# EAGLE schematic VCO (EAGLE 8.6.0)
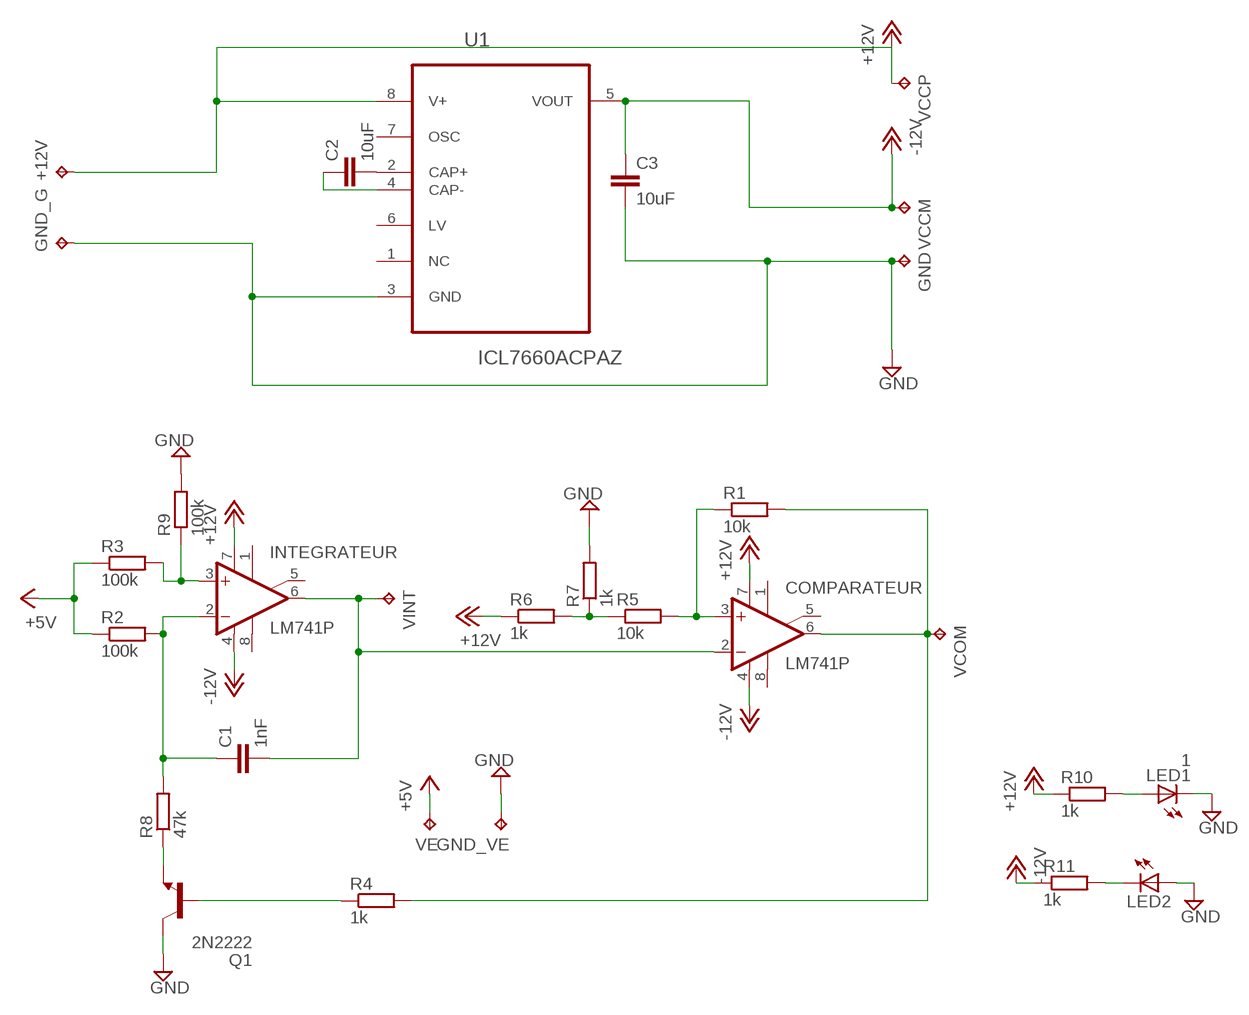
[diagram p0: schematic, sheet 1]

## Parts
+12V  TPPAD1-13  [P1-13]
C1  1nF  C050-025X075  [C050-025X075]
C2  10uF  C050-025X075  [C050-025X075]
C3  10uF  C050-025X075  [C050-025X075]
COMPARATEUR  LM741P  [DIL08]
GND  TPPAD1-13  [P1-13]
GND_G  TPPAD1-13  [P1-13]
GND_VE  TPPAD1-13  [P1-13]
INTEGRATEUR  LM741P  [DIL08]
LED1  1  LED5MM  [LED5MM]
LED2  LED5MM  [LED5MM]
Q1  2N2222  [TO18]
R1  10k  R0204/7  [0204/7]
R2  100k  R0204/7  [0204/7]
R3  100k  R0204/7  [0204/7]
R4  1k  R0204/7  [0204/7]
R5  10k  R0204/7  [0204/7]
R6  1k  R0204/7  [0204/7]
R7  1k  R0204/7  [0204/7]
R8  47k  R0204/7  [0204/7]
R9  100k  R0204/7  [0204/7]
R10  1k  R0204/7  [0204/7]
R11  1k  R0204/7  [0204/7]
U1  ICL7660ACPAZ  [DIP254P762X533-8]
VCCM  TPPAD1-13  [P1-13]
VCCP  TPPAD1-13  [P1-13]
VCOM  TPPAD1-13  [P1-13]
VE  TPPAD1-13  [P1-13]
VINT  TPPAD1-13  [P1-13]

## Nets
+5V: R2.1 R3.1 VE.TP
+12V: +12V.TP COMPARATEUR.7(V+) INTEGRATEUR.7(V+) R6.1 R10.1 U1.8(V+) VCCP.TP
-12V: C3.1 COMPARATEUR.4(V-) INTEGRATEUR.4(V-) R11.1 U1.5(VOUT) VCCM.TP
GND: C3.2 GND.TP GND_G.TP GND_VE.TP LED1.K(C) LED2.A Q1.3(C) R7.2 R9.2 U1.3(GND)
N$2: INTEGRATEUR.3(+IN) R3.2 R9.1
N$3: Q1.1(E) R8.1
N$4: Q1.2(B) R4.1
N$5: C1.1 INTEGRATEUR.2(-IN) R2.2 R8.2
N$6: C1.2 COMPARATEUR.2(-IN) INTEGRATEUR.6(OUT) VINT.TP
N$7: R5.1 R6.2 R7.1
N$8: COMPARATEUR.3(+IN) R1.1 R5.2
N$9: C2.2 U1.2(CAP+)
N$10: COMPARATEUR.6(OUT) R1.2 R4.2 VCOM.TP
N$11: LED1.A R10.2
N$12: LED2.K(C) R11.2
N$13: C2.1 U1.4(CAP-)
Unconnected: COMPARATEUR.1(ON1) COMPARATEUR.5(ON2) COMPARATEUR.8(OPT) INTEGRATEUR.1(ON1) INTEGRATEUR.5(ON2) INTEGRATEUR.8(OPT) U1.1(NC) U1.6(LV) U1.7(OSC)

## Library data of the parts
+12V GND GND_G GND_VE VCCM VCCP VCOM VE VINT = testpad:TP: Test pad
C1-C3 = VCO:C: CAPACITOR, European symbol
COMPARATEUR INTEGRATEUR = VCO:*741: OP AMP
LED1 LED2 = VCO:LED: LED OSRAM: - CHIPLED LG R971, LG N971, LY N971, LG Q971, LY Q971, LO R971, LY R971 LH N974, LH R974 LS Q976, LO Q976, LY Q976 LO Q996 - Hyper CHIPLED LW Q18S LB Q993, LB Q99A, LB R99A - SideLED LS A670, LO A670, LY A670, LG A670, LP A670 LB A673, LV A673, LT A673, LW A673 LH A674 LY A675 LS A676, LA A676, LO A676, LY A676, LW A676 LS A679, LY A679, LG A679 - Hyper Micro SIDELED® LS Y876, LA Y876, LO Y876, LY Y876 LT Y87S - SmartLED LW L88C, LW L88S LB L89C, LB L89S, LG L890 LS L89K, LO L89K, LY L89K LS L896, LA L896, LO L896, LY L896 - TOPLED LS T670, LO T670, LY T670, LG T670, LP T670 LSG T670, LSP T670, LSY T670, LOP T670, LYG T670 LG T671, LOG T671, LSG T671 LB T673, LV T673, LT T673, LW T673 LH T674 LS T676, LA T676, LO T676, LY T676, LB T676, LH T676, LSB T676, LW T676 LB T67C, LV T67C, LT T67C, LS T67K, LO T67K, LY T67K, LW E67C LS E67B, LA E67B, LO E67B, LY E67B, LB E67C, LV E67C, LT E67C LW T67C LS T679, LY T679, LG T679 LS T770, LO T770, LY T770, LG T770, LP T770 LB T773, LV T773, LT T773, LW T773 LH T774 LS E675, LA E675, LY E675, LS T675 LS T776, LA T776, LO T776, LY T776, LB T776 LHGB T686 LT T68C, LB T68C - Hyper Mini TOPLED® LB M676 - Mini TOPLED Santana® LG M470 LS M47K, LO M47K, LY M47K Source: http://www.osram.convergy.de LUXEON: - LUMILED® LXK2-PW12-R00, LXK2-PW12-S00, LXK2-PW14-U00, LXK2-PW14-V00 LXK2-PM12-R00, LXK2-PM12-S00, LXK2-PM14-U00 LXK2-PE12-Q00, LXK2-PE12-R00, LXK2-PE12-S00, LXK2-PE14-T00, LXK2-PE14-U00 LXK2-PB12-K00, LXK2-PB12-L00, LXK2-PB12-M00, LXK2-PB14-N00, LXK2-PB14-P00, LXK2-PB14-Q00 LXK2-PR12-L00, LXK2-PR12-M00, LXK2-PR14-Q00, LXK2-PR14-R00 LXK2-PD12-Q00, LXK2-PD12-R00, LXK2-PD12-S00 LXK2-PH12-R00, LXK2-PH12-S00 LXK2-PL12-P00, LXK2-PL12-Q00, LXK2-PL12-R00 Source: www.luxeon.com KINGBRIGHT: KA-3528ASYC Source: www.kingbright.com
Q1 = VCO:2N2222*: NPN Transistor
R1-R11 = VCO:R: RESISTOR, European symbol
U1 = ICL7660:ICL7660ACPAZ: CMOS Voltage Converters; MPN: ICL7660ACPAZ; OC_FARNELL: 1562064; OC_NEWARK: 79K6924; PACKAGE: PDIP-8; SUPPLIER: INTERSIL